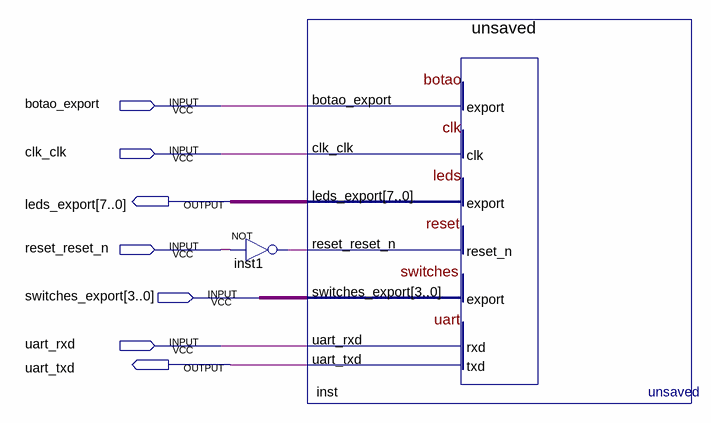
[diagram p0: schematic sheet]
// Quartus schematic loopback.bdf as structural Verilog: 2 symbols, 7 pins
module loopback (
  input  botao_export,
  input  clk_clk,
  input  reset_reset_n,
  input  [3:0] switches_export,
  input  uart_rxd,
  output [7:0] leds_export,
  output uart_txd
);

  wire inst1_out;

  not inst1 (inst1_out, reset_reset_n);
  unsaved inst (
    .botao_export(botao_export), .clk_clk(clk_clk), .reset_reset_n(inst1_out),
    .switches_export(switches_export), .uart_rxd(uart_rxd), .leds_export(leds_export), .uart_txd(uart_txd));
endmodule
